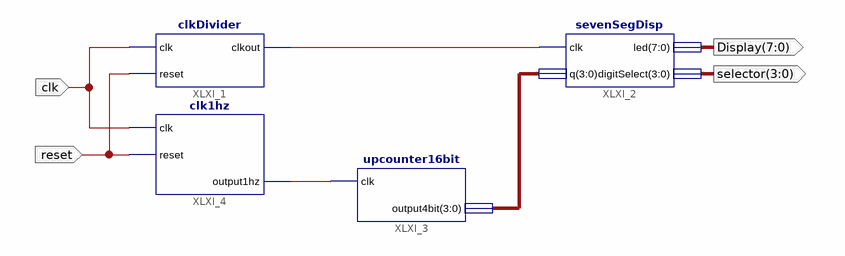
[diagram p0: schematic sheet 1]
// Xilinx ISE schematic top.sch (spartan3e) as structural Verilog: 4 symbols, 4 ports
module top (
  input  clk,
  input  reset,
  output [7:0] Display,
  output [3:0] selector
);

  wire XLXN_5, XLXN_12;
  wire [3:0] XLXN_7;

  sevenSegDisp XLXI_2 (.clk(XLXN_5), .q(XLXN_7), .led(Display), .digitSelect(selector));
  clkDivider XLXI_1 (.clk(clk), .reset(reset), .clkout(XLXN_5));
  upcounter16bit XLXI_3 (.clk(XLXN_12), .output4bit(XLXN_7));
  clk1hz XLXI_4 (.clk(clk), .reset(reset), .output1hz(XLXN_12));
endmodule
